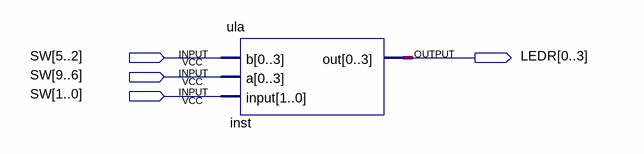
[diagram p0: schematic sheet]
// Quartus schematic test_ula.bdf as structural Verilog: 1 symbols, 4 pins
module test_ula (
  input  [9:0] SW,
  output [0:3] LEDR
);

  ula inst (.out(LEDR));  // open: b, a, input
endmodule
